# EAGLE design raspi-adapter (EAGLE 6.5.0)
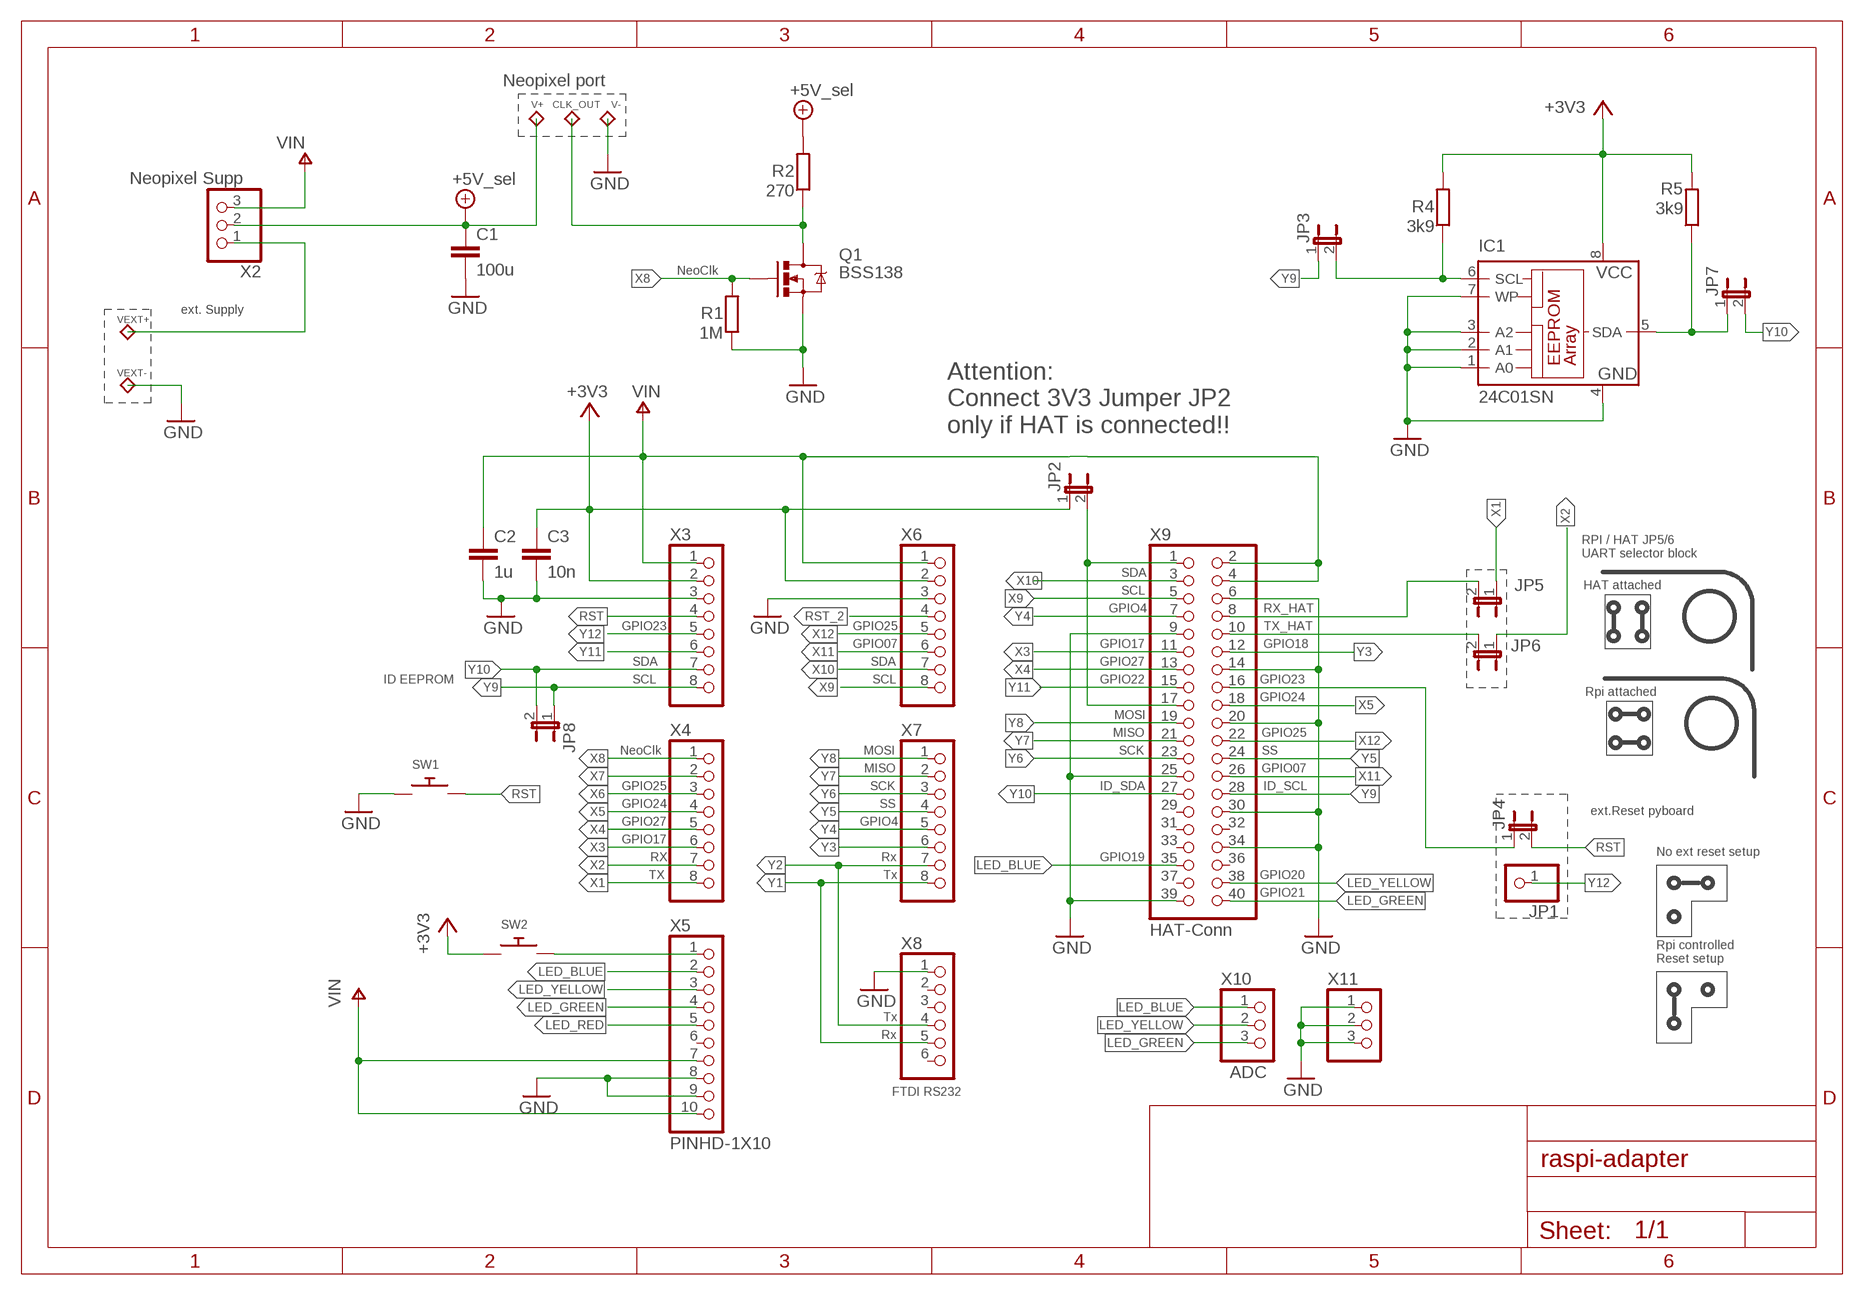
[diagram p0: schematic, sheet 1]

## Parts
C1  100u  C-EUC2220K  [C2220K]
C2  1u  C-EUC0603  [C0603]
C3  10n  C-EUC0603  [C0603]
CLK_OUT  TP_BATT  [TP_BATT_GROSS]
IC1  24C01SN  [SO-08]
JP1  PINHD-1X1  [1X01]
JP2  JUMPER-2PTH  [1X02]
JP3  JUMPER-2PTH  [1X02]
JP4  JUMPER-2PTH  [1X02]
JP5  JUMPER-2PTH  [1X02]
JP6  JUMPER-2PTH  [1X02]
JP7  JUMPER-2PTH  [1X02]
JP8  JUMPER-2PTH  [1X02]
Q1  BSS138  MOSFET-NCHANNELBSS123LT1G  [SOT23]
R1  1M  R-EU_R0603  [R0603]
R2  270  R-EU_R0603  [R0603]
R4  3k9  R-EU_R0603  [R0603]
R5  3k9  R-EU_R0603  [R0603]
SW1  SWITCH_PUSHBUTTONSOFTTOUCHSMD_SJ  [PUSHBUTTON_SMD_SJ]
SW2  SWITCH_PUSHBUTTONSOFTTOUCHSMD_SJ  [PUSHBUTTON_SMD_SJ]
V+  V+  TP_BATT  [TP_BATT_GROSS]
V-  TP_BATT  [TP_BATT_GROSS]
VEXT+  TP_BATT  [TP_BATT_GROSS]
VEXT-  TP_BATT  [TP_BATT_GROSS]
X2  PINHD-1X3  [1X03]
X3  PINHD-1X8CLEANBIG  [1X08-CLEANBIG]
X4  PINHD-1X8CLEANBIG  [1X08-CLEANBIG]
X5  PINHD-1X10  [1X10-BIG]
X6  PINHD-1X8CLEANBIG  [1X08-CLEANBIG]
X7  PINHD-1X8CLEANBIG  [1X08-CLEANBIG]
X8  PINHD-1X6B  [1X06-BIG]
X9  HAT-Conn  PINHD-2X20  [2X20]
X10  PINHD-1X3  [1X03]
X11  PINHD-1X3  [1X03]

## Nets
3V3_RPI: JP2.2 X9.1 X9.17
+3V3: C3.1 IC1.8(VCC) JP2.1 R4.2 R5.2 SW2.P$1 X3.2 X6.2
+5V: C1.1 R2.2 V+.1 X2.2 ; supply symbol labelled +5V_sel
GND: C1.2 C2.2 C3.2 IC1.1(A0) IC1.2(A1) IC1.3(A2) IC1.4(GND) IC1.7(WP) Q1.2(S) R1.1 SW1.P$1 V-.1 VEXT-.1 X3.3 X5.8 X5.9 X6.3 X8.1 X9.6 X9.9 X9.14 X9.20 X9.25 X9.30 X9.34 X9.39 X11.1 X11.2 X11.3
LED_BLUE: X5.2 X9.35 X10.1
LED_GREEN: X5.4 X9.40 X10.3
LED_RED: X5.5
LED_YELLOW: X5.3 X9.38 X10.2
N$2: VEXT+.1 X2.1
N$4: SW2.P$2 X5.1
N$6: CLK_OUT.1 Q1.3(D) R2.1
N$7: JP4.1 X9.16
RST: JP4.2 SW1.P$2 X3.4
RST_2: X6.4
SCL: IC1.6(SCL) JP3.2 R4.1
SDA: IC1.5(SDA) JP7.1 R5.1
V+: C2.1 X2.3 X3.1 X6.1 X9.2 X9.4 ; supply symbol labelled VIN
VIN: X5.7 X5.10
X1: JP5.1 X4.8
X1_: JP5.2 X9.8
X2: JP6.1 X4.7
X2_2: JP6.2 X9.10
X3: X4.6 X9.11
X4: X4.5 X9.13
X5: X4.4 X9.18
X6: X4.3
X7: X4.2
X8: Q1.1(G) R1.2 X4.1
X9: X6.8 X9.5
X10: X6.7 X9.3
X11: X6.6 X9.26
X12: X6.5 X9.22
Y1: X7.8 X8.5
Y2: X7.7 X8.4
Y3: X7.6 X9.12
Y4: X7.5 X9.7
Y5: X7.4 X9.24
Y6: X7.3 X9.23
Y7: X7.2 X9.21
Y8: X7.1 X9.19
Y9: JP3.1 JP8.1 X3.8 X9.28
Y10: JP7.2 JP8.2 X3.7 X9.27
Y11: X3.6 X9.15
Y12: JP1.1 X3.5
Unconnected: X5.6 X8.2 X8.3 X8.6 X9.29 X9.31 X9.32 X9.33 X9.36 X9.37

## Notes on the sheet
- Neopixel port
- Neopixel Supp
- NeoClk
- ext. Supply
- Attention:
  Connect 3V3 Jumper JP2
  only if HAT is connected!!
- RPI / HAT JP5/6
  UART selector block
- SDA
- HAT attached
- SCL
- GPIO4 | RX_HAT
- GPIO23 | GPIO25 | TX_HAT
- GPIO07 | GPIO17 | GPIO18
- SDA | SDA | GPIO27
- ID EEPROM | SCL | SCL | GPIO22 | GPIO23
- Rpi attached
- GPIO24
- MOSI
- MISO
- GPIO25
- SCK | SS
- NeoClk | MOSI
- MISO
- GPIO07
- SCK
- GPIO25 | ID_SDA | ID_SCL
- SS
- GPIO24
- ext.Reset pyboard
- GPIO27 | GPIO4
- GPIO17
- No ext reset setup
- RX | Rx | GPIO19
- TX | Tx | GPIO20
- GPIO21
- Rpi controlled 
  Reset setup
- Tx
- Rx
- ADC
- FTDI RS232

## Library data of the parts
C1-C3 = rcl:C-EU: CAPACITOR, European symbol
CLK_OUT V+ V- VEXT+ VEXT- = GasDemo:TP_BATT
IC1 = microchip:24C*: Serial EEPROM 1 K/2 K/4 K; MPN: CAT24C01WI-GT3; OC_FARNELL: 1718117; OC_NEWARK: 06R0487
JP1 = adafruit:PINHD-1X1: Pin header 1x1 for 0.1" spacing With round pins
JP2-JP8 = SparkFun-Passives:JUMPER-2: Jumper Basic 0.1" spaced jumper. Use with breakaway headers.
Q1 = SparkFun-DiscreteSemi:MOSFET-NCHANNEL: Common NMOSFET Parts MFG P/N Store ID Prod ID FDD8780 TRANS-09984 SI7820DN TRANS-11055 FDS6630A IC-08089 2N7002PW TRANS-11151 FQP30N06L COM-10213 TRANS-10060 BSS123LT1G TRANS-08345 BSS138 TRANS-00830 BS170 2N7000; PROD_ID: TRANS-08345
R1 R2 R4 R5 = resistor:R-EU_: RESISTOR, European symbol
SW1 SW2 = adafruit:SWITCH_PUSHBUTTON: Buttons SOFTTOUCHSMD_SJ - Soft touch temporary push button (Super Junk Akihabara) Compatible with SKPMANE010 [Mouser: 688-SKPMAN] C&K_KSS = Digikey: KSS221GLFS
X2 X10 X11 = adafruit:PINHD-1X3: PIN HEADER
X3 X4 X6 X7 = adafruit:PINHD-1X8: PIN HEADER
X5 = adafruit:PINHD-1X10: Pin header 1x10 0.1" spacing With round pins
X8 = adafruit:PINHD-1X6: PIN HEADER
X9 = adafruit:PINHD-2X20: PIN HEADER

## Board
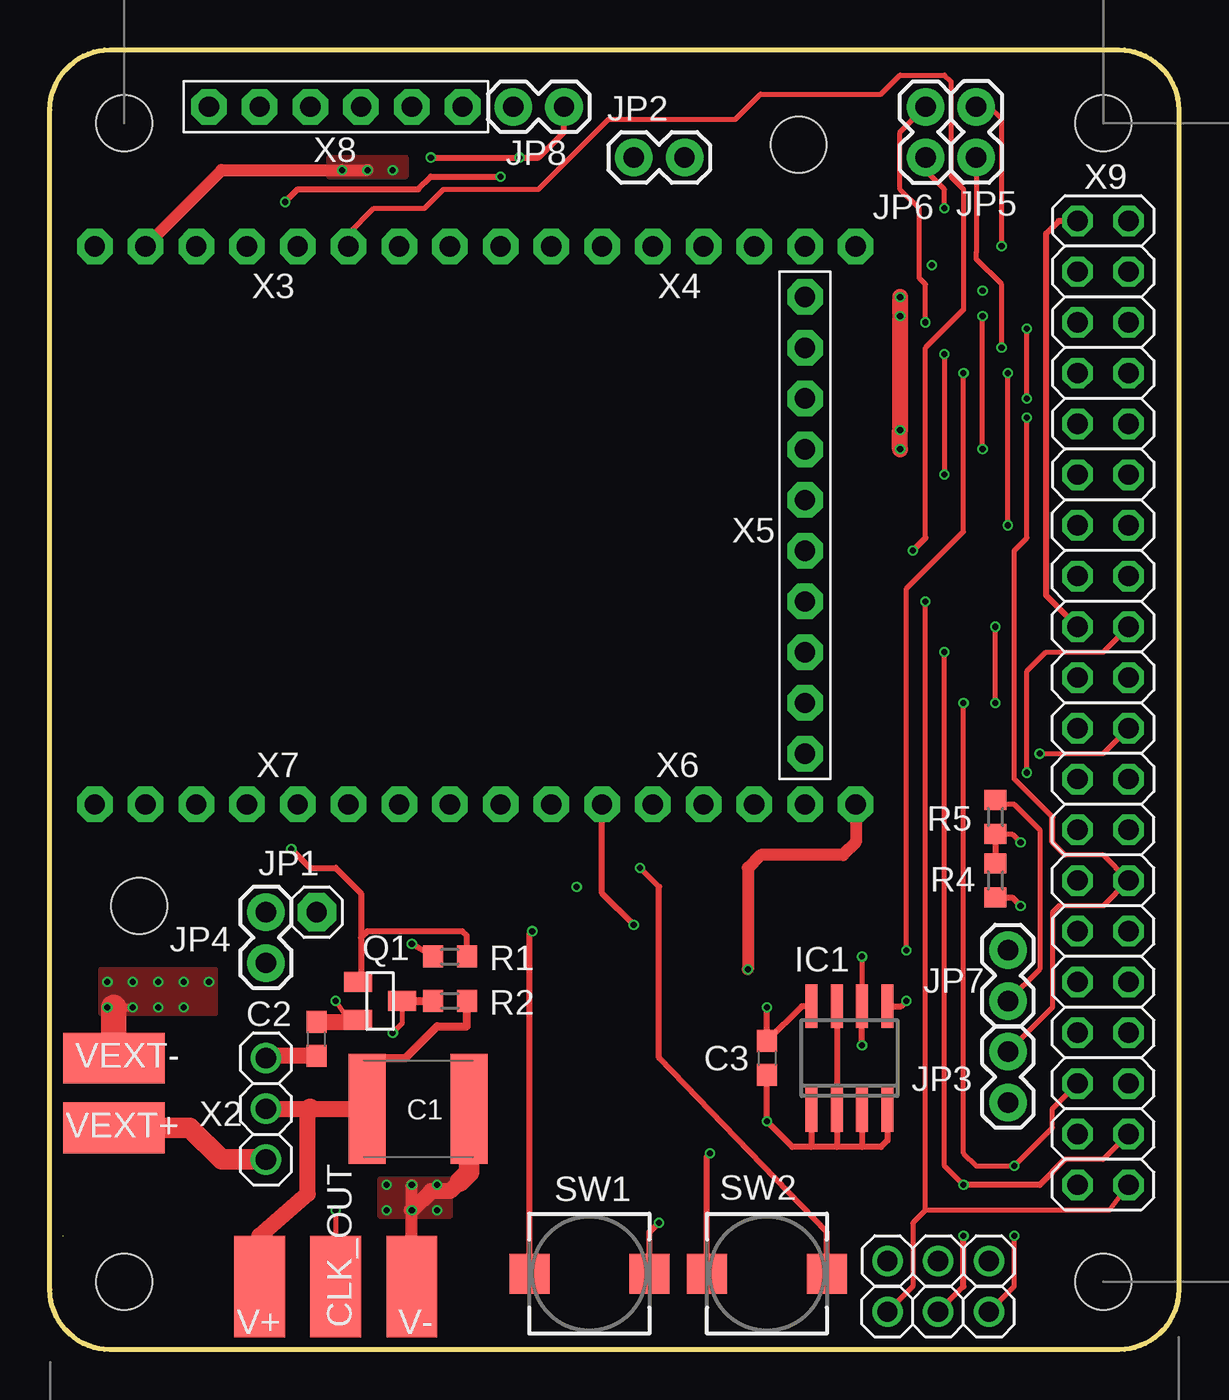
[diagram p1: board, top side]
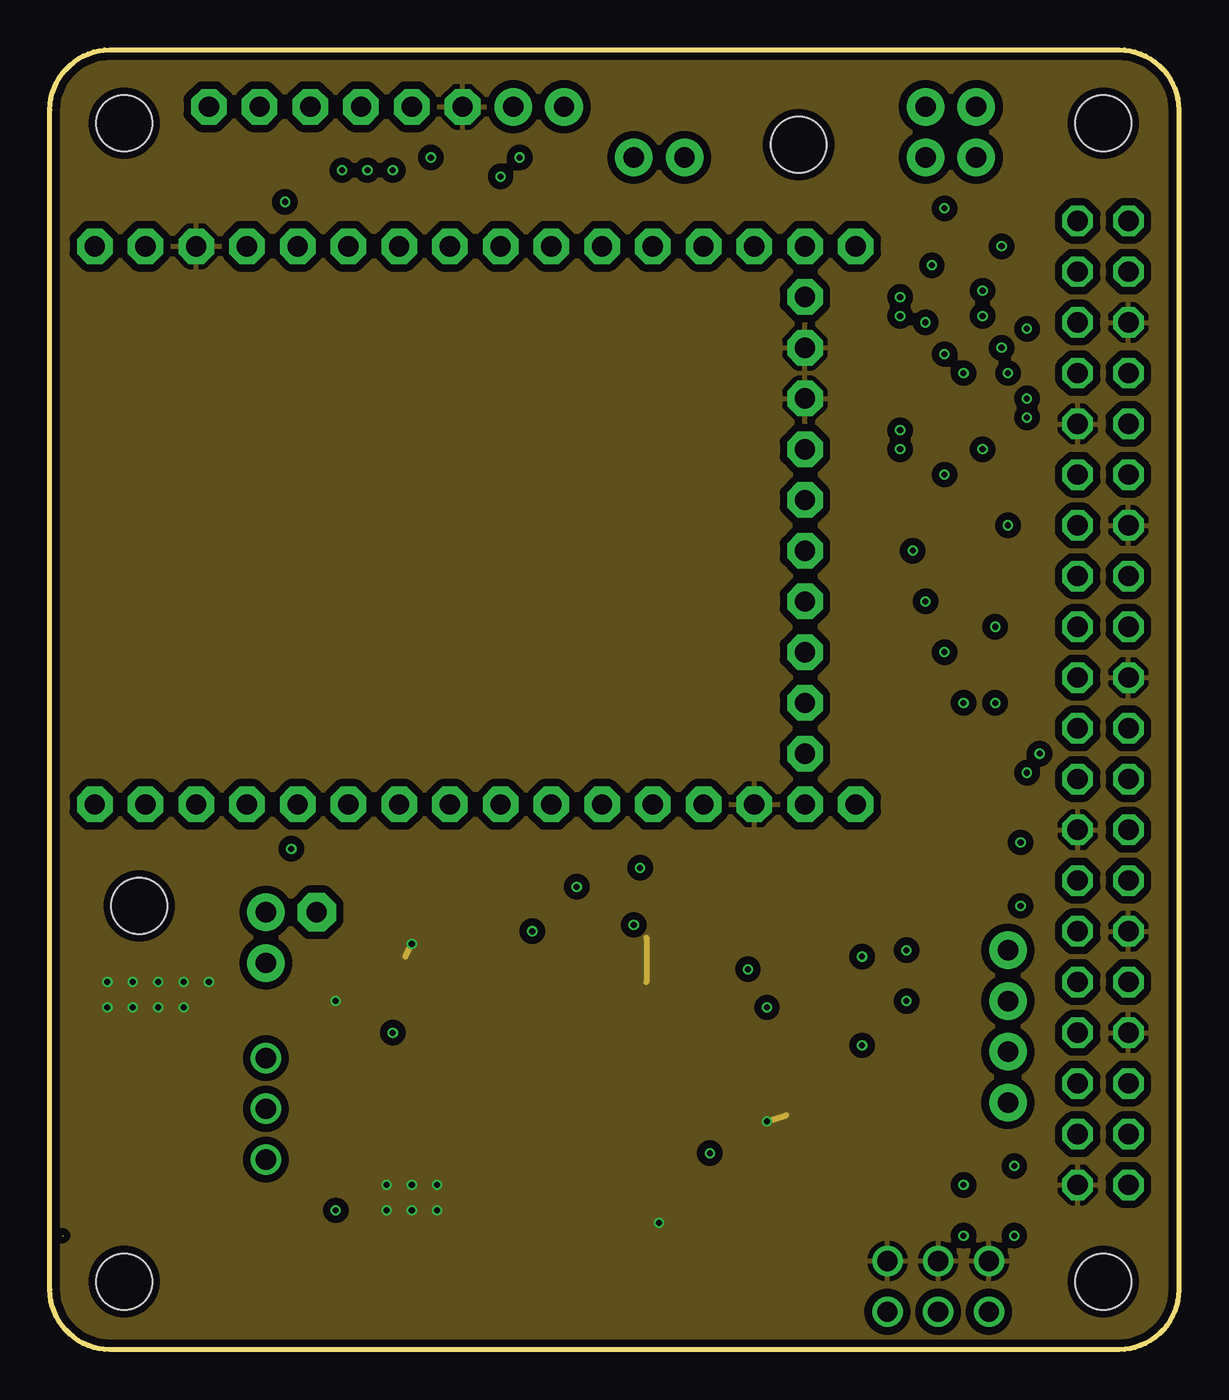
[diagram p2: board, inner layer Route2]
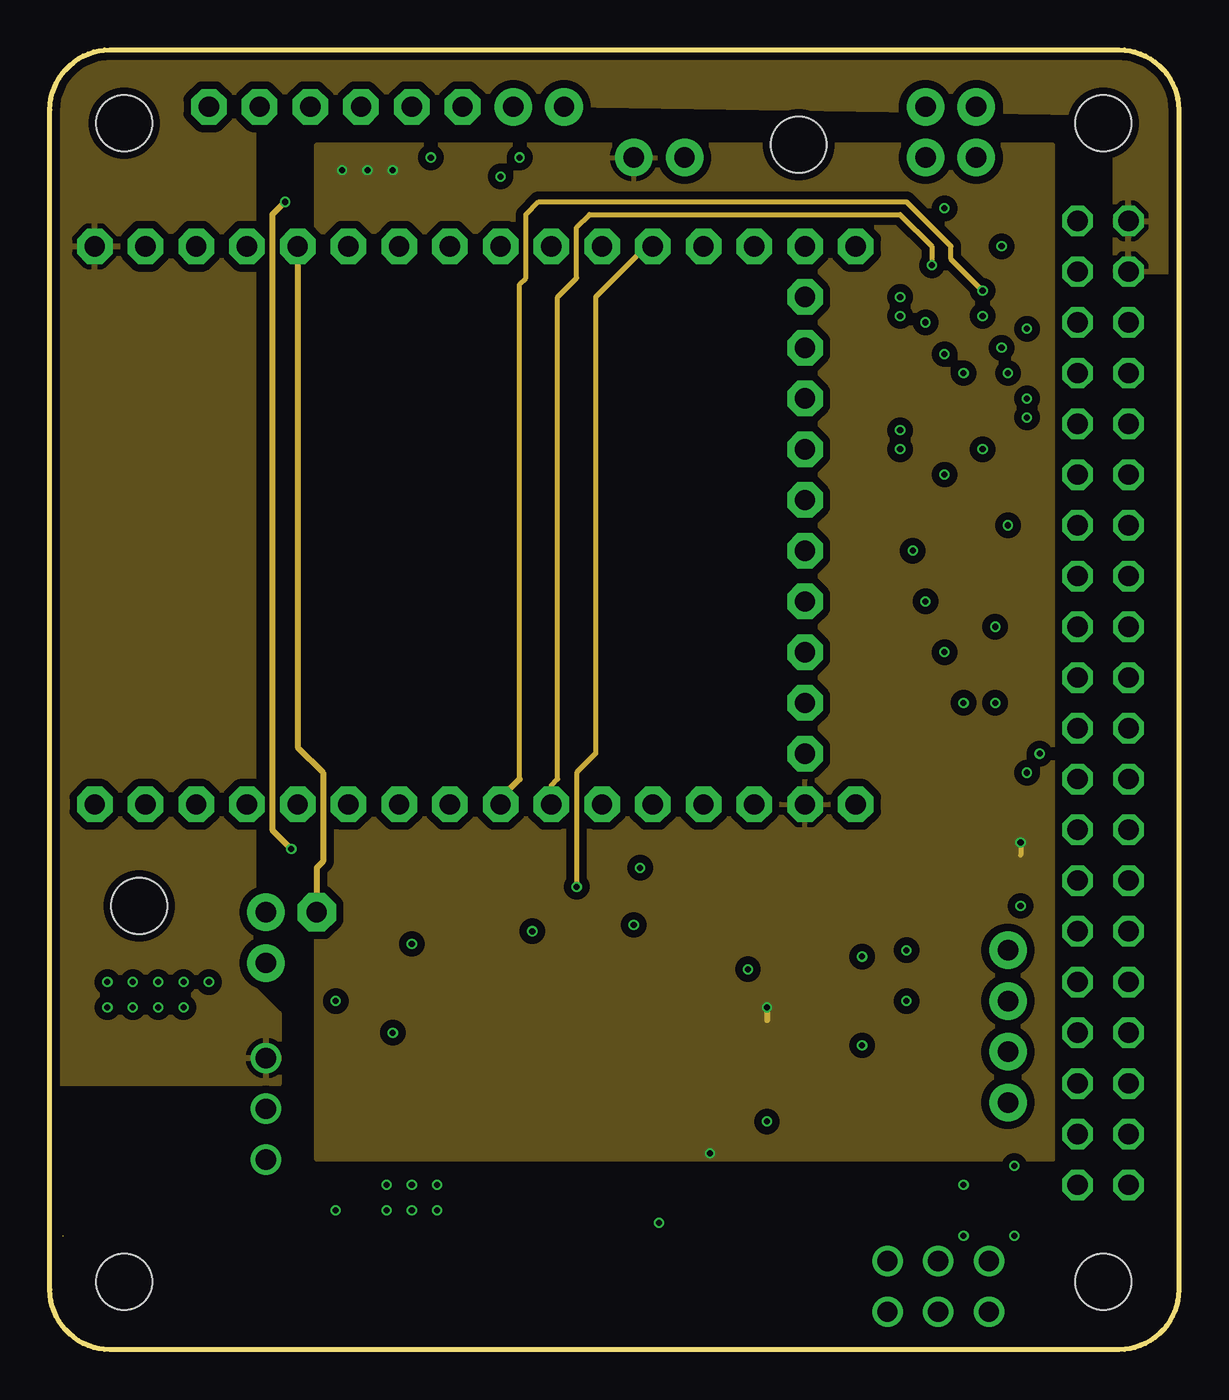
[diagram p3: board, inner layer Route15]
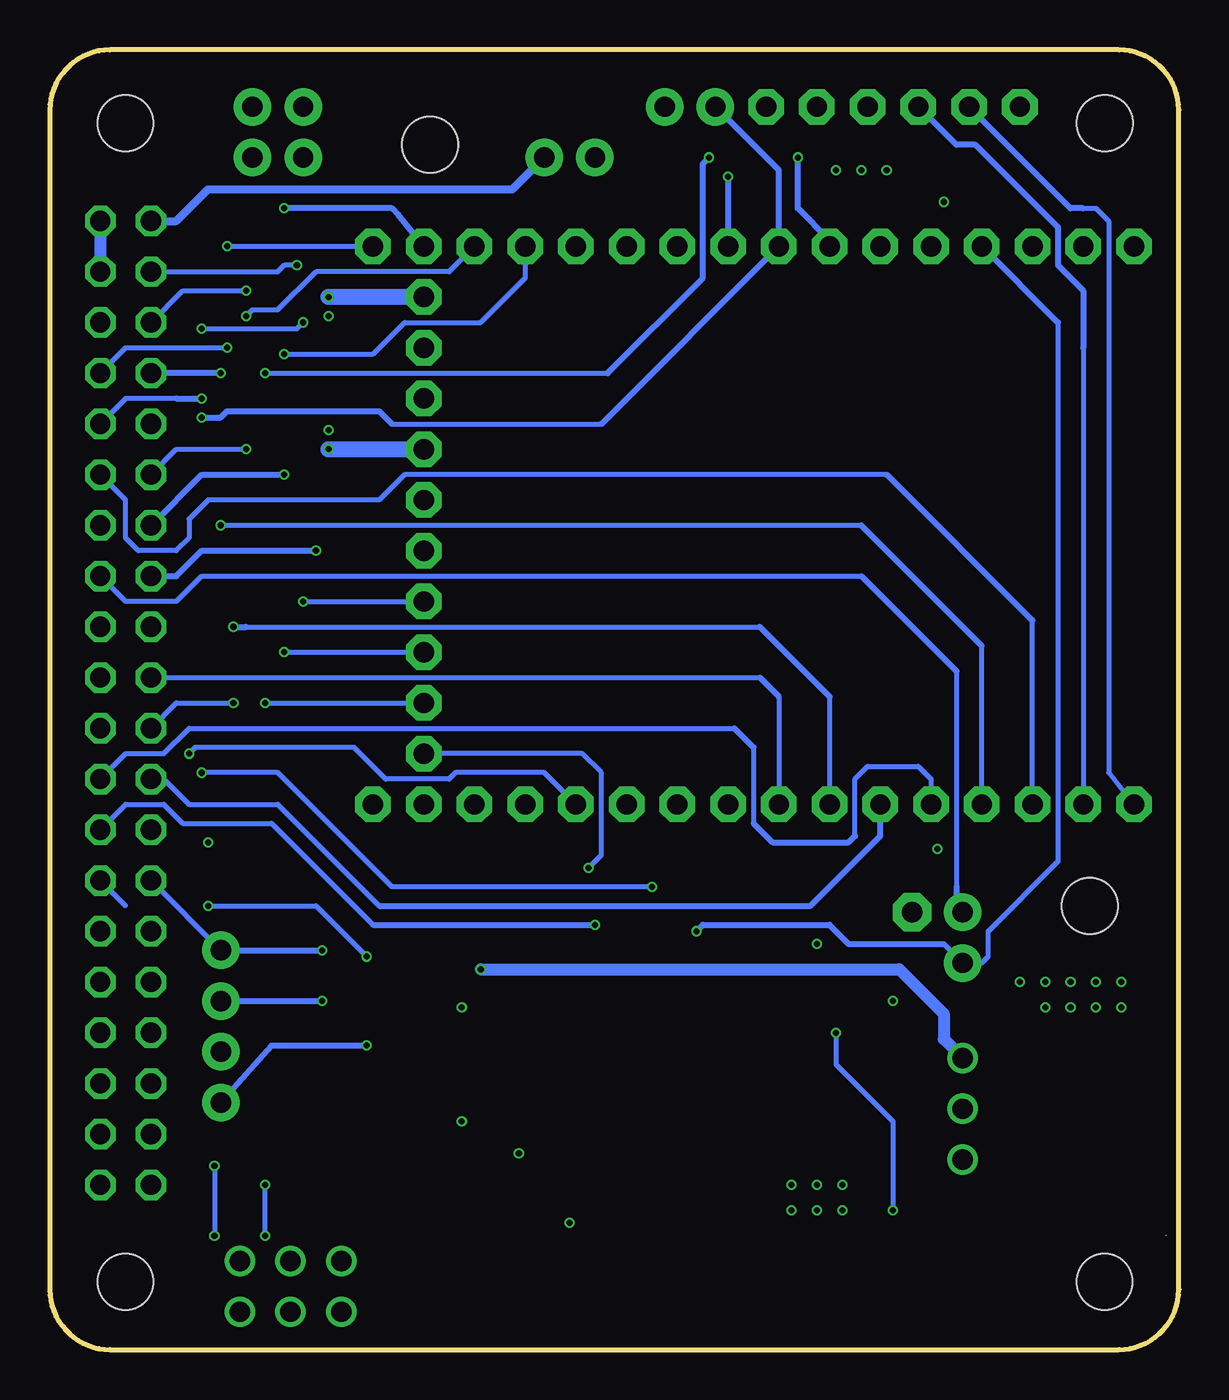
[diagram p4: board, bottom side, seen from below]

Size 56.52 x 65.06 mm. Coordinates in mm from the lower left corner, seen from the top.
Outline: 0.63,5.7 0.65,5.7
Outline: 56.52,62.06 56.52,3 arc-90 53.52,0 3,0 arc-90 0,3 0,62.06 arc-90 3,65.06 53.52,65.06 arc-90 56.52,62.06
Copper layers (1*2*15*16): Top 0.035559375mm / dielectric 0.17018125mm / Route2 0.01778125mm / dielectric 47mil / Route15 0.01778125mm / dielectric 0.17018125mm / Bottom 0.035559375mm
Design rules "OSHPark-4layer": minimum track width 5mil, minimum drill 10mil, track to track 5mil, track to pad 5mil, pad to pad 5mil, via to via 5mil, smd to smd 5mil, copper to edge 15mil, drill to drill 6mil, minimum pad ring 4mil, minimum via ring 4mil, stop-mask expansion 2.5mil, vias tented up to drill 0mil, thermal gap 10mil
Holes 2.8 mm at 4.46,22.21 37.48,60.31 52.73,3.4 52.73,61.4 3.71,61.4 3.72,3.4

### Footprints (pad centres in the part's own frame; a part is rotated, then mirrored left to right if it is on the bottom)
C2220K = smd 1.85 x 5.5: 1 -2.55,0; 2 2.55,0
C0603 = smd 1.1 x 1: 1 -0.85,0; 2 0.85,0
TP_BATT_GROSS = smd 5.08 x 2.54: 1 0,0
SO-08 = smd 0.6 x 2.2: 1 -1.905,-2.6; 2 -0.635,-2.6; 3 0.635,-2.6; 4 1.905,-2.6; 5 1.905,2.6; 6 0.635,2.6; 7 -0.635,2.6; 8 -1.905,2.6
1X01 = drill 1.016 pad 1.93 octagon: 1 0,0
1X02 = drill 1.016 pad 1.88: 1 0,0; 2 2.54,0
SOT23 = smd 1 x 1.4: 1 -0.95,-1.1; 2 0.95,-1.1; 3 0,1.1
R0603 = smd 1 x 1.1: 1 -0.85,0; 2 0.85,0
PUSHBUTTON_SMD_SJ = smd 2 x 2: P$1 3,0; P$2 -3,0
1X03 = drill 1.016: 1 -2.54,0; 2 0,0; 3 2.54,0
1X08-CLEANBIG = drill 1.016 pad 1.778 octagon: 1 -8.89,0; 2 -6.35,0; 3 -3.81,0; 4 -1.27,0; 5 1.27,0; 6 3.81,0; 7 6.35,0; 8 8.89,0
1X10-BIG = drill 1.016 pad 1.778 octagon: 1 -11.43,0; 2 -8.89,0; 3 -6.35,0; 4 -3.81,0; 5 -1.27,0; 6 1.27,0; 7 3.81,0; 8 6.35,0; 9 8.89,0; 10 11.43,0
1X06-BIG = drill 1.016 pad 1.778 octagon: 1 -6.35,0; 2 -3.81,0; 3 -1.27,0; 4 1.27,0; 5 3.81,0; 6 6.35,0
2X20 = drill 1.016 octagon: 1 -24.13,-1.27; 2 -24.13,1.27; 3 -21.59,-1.27; 4 -21.59,1.27; 5 -19.05,-1.27; 6 -19.05,1.27; 7 -16.51,-1.27; 8 -16.51,1.27; 9 -13.97,-1.27; 10 -13.97,1.27; 11 -11.43,-1.27; 12 -11.43,1.27; 13 -8.89,-1.27; 14 -8.89,1.27; 15 -6.35,-1.27; 16 -6.35,1.27; 17 -3.81,-1.27; 18 -3.81,1.27; 19 -1.27,-1.27; 20 -1.27,1.27; 21 1.27,-1.27; 22 1.27,1.27; 23 3.81,-1.27; 24 3.81,1.27; 25 6.35,-1.27; 26 6.35,1.27; 27 8.89,-1.27; 28 8.89,1.27; 29 11.43,-1.27; 30 11.43,1.27; 31 13.97,-1.27; 32 13.97,1.27; 33 16.51,-1.27; 34 16.51,1.27; 35 19.05,-1.27; 36 19.05,1.27; 37 21.59,-1.27; 38 21.59,1.27; 39 24.13,-1.27; 40 24.13,1.27

### Placement (x,y rotation side)
C1  18.43,12.05 0 top
C2  13.36,15.54 90 top
C3  35.9,14.59 270 top
CLK_OUT  14.31,3.16 90 top
IC1  40.02,14.59 0 top
JP1  13.36,21.89 0 top
JP2  29.23,59.68 0 top
JP3  47.96,14.91 270 top
JP4  10.82,21.89 270 top
JP5  46.38,62.22 270 top
JP6  43.84,59.68 90 top
JP7  47.96,17.45 90 top
JP8  23.2,62.22 0 top
Q1  16.53,17.45 270 top
R1  20.02,19.67 0 top
R2  20.02,17.45 0 top
R4  47.33,23.48 90 top
R5  47.33,26.66 270 top
SW1  27.01,3.8 0 top
SW2  35.9,3.8 180 top
V+  10.5,3.16 90 top
V-  18.12,3.16 90 top
VEXT+  3.2,11.1 180 top
VEXT-  3.2,14.59 180 top
X2  10.82,12.05 90 top
X3  11.13,55.23 0 top
X4  31.45,55.23 0 top
X5  37.8,41.26 90 top
X6  31.45,27.29 180 top
X7  11.13,27.29 180 top
X8  14.31,62.22 180 top
X9  52.73,32.37 270 top
X10  44.47,1.89 180 top
X11  44.47,4.43 0 top

### Tracks (layer width: path | path; a pad name or v marks a point on that pad's centre or on a via)
3V3_RPI
  Top 0.305: X9.1 50.5,56.5 49.87,55.87 49.87,37.77 X9.17
  Bottom 0.406: X9.1 50.19,56.5 48.6,58.09 33.36,58.09 JP2.2
+3V3  (via drill 0.3)
  Top 0.254: R5.2 48.18,25.81 v48.6,25.39
  Top 0.305: IC1.8 37.65,17.19 C3.1 v35.9,17.13 | R5.2 R4.2 | SW2.P$1 32.9,9.69 v33.04,9.83
  Top 0.61: X3.2 8.59,59.04 v14.62,59.04 v15.89,59.04
  Route15 0.254: v48.6,25.39 48.6,24.75
  Route15 0.305: v35.9,17.13 35.9,16.5
  other vias: 17.16,59.04
  pour Route15 (isolate 0.381): 13.36,60.31 50.19,60.31 50.19,9.51 13.36,9.51
  pour Top: 17.8,59.68 17.8,58.72 13.99,58.72 13.99,59.68
+5V
  Top 0.406: C1.1 15.13,13.83 15.89,14.59 17.8,14.59 19.39,16.18 20.87,16.18 R2.2
  Top 0.813: V+.1 10.5,5.7 12.91,7.8 12.91,11.92 | X2.2 13.04,12.05 C1.1
  Top 1.016: 12.91,11.92 13.04,12.05
GND  (via drill 0.3)
  Top 0.254: Q1.2 14.95,16.5 v14.31,17.45
  Top 0.305: IC1.4 41.93,10.46 41.61,10.15 40.66,10.15 | 40.66,10.15 39.39,10.15 | 39.39,10.15 38.12,10.15 | 38.12,10.15 37.17,10.15 v35.9,11.42 C3.2 | IC1.1 38.12,10.15 | 39.39,10.15 IC1.2 IC1.7 | IC1.3 40.66,10.15 | SW1.P$1 30.01,5.88 v30.5,6.34 | R1.1 v18.12,20.31
  Top 0.406: 3.2,17.13 v4.15,17.13
  Top 0.61: V-.1 v18.12,6.97 v18.12,8.24
  Top 0.813: C2.2 15.32,16.4 Q1.2 | 20.53,8.43 20.02,7.93 19.07,7.93 v18.12,6.97
  Top 1.016: C1.2 20.98,8.88 20.53,8.43
  Top 1.27: VEXT-.1 3.2,17.13
  Route2 0.305: 29.87,20.63 29.87,18.4 | v35.9,11.42 36.85,11.74 | v18.12,20.31 17.8,19.67
  other vias: 2.88,17.13 5.42,17.13 5.42,18.4 4.15,18.4 2.88,18.4 6.69,17.13 7.96,18.4 6.69,18.4 16.85,6.97 19.39,6.97 19.39,8.24 16.85,8.24
  pour Route2 (isolate 0.381): -3.16,66.66 59.07,66.66 59.07,-0.65 -3.16,-0.65
  pour Top: 2.56,19.04 8.28,19.04 8.28,16.81 2.56,16.81
  pour Top: 16.53,8.56 20.02,8.56 20.02,6.65 16.53,6.65
LED_BLUE  (via drill 0.3)
  Top 0.254: v45.74,32.37 45.74,9.83 46.38,9.19 v48.28,9.19 50.19,11.1 50.19,12.05 X9.35 | 47.33,2.21 48.28,3.16 v48.28,5.7
  Top 0.305: X10.1 47.33,2.21
  Bottom 0.254: v45.74,32.37 X5.2 | v48.28,9.19 v48.28,5.7
LED_GREEN  (via drill 0.3)
  Top 0.254: X9.40 53.04,6.97 43.84,6.97 | 43.84,6.97 v43.84,37.45 | 43.84,6.97 43.2,6.34 43.2,3.16 X10.3
  Bottom 0.254: v43.84,37.45 X5.4
LED_YELLOW  (via drill 0.3)
  Top 0.254: X9.38 52.73,9.51 50.82,9.51 | v45.74,8.24 44.79,9.19 v44.79,34.91 | 44.79,2.21 45.74,3.16
  Top 0.305: 50.82,9.51 49.55,8.24 v45.74,8.24 | X10.2 44.79,2.21 | 45.74,3.16 v45.74,5.7
  Bottom 0.254: v44.79,34.91 X5.3 | v45.74,5.7 v45.74,8.24
N$2
  Top 1.016: X2.1 8.59,9.51 7,11.1 VEXT+.1
N$4  (via drill 0.3)
  Top 0.254: 30.5,23.17 v29.55,24.12
  Top 0.305: SW2.P$2 38.9,5.88 30.5,14.59 30.5,23.17
  Bottom 0.254: v29.55,24.12 28.91,24.75 28.91,28.88 29.87,29.83 X5.1
N$6  (via drill 0.3)
  Top 0.254: v14.31,6.97 CLK_OUT.1 | Q1.3 17.63,16.33 v17.16,15.86
  Top 0.305: 14.94,1.89 CLK_OUT.1
  Top 0.406: Q1.3 18.65,17.45 R2.1
  Bottom 0.254: v14.31,6.97 14.31,11.42 17.16,14.27 v17.16,15.86
N$7
  Bottom 0.254: 15.89,38.72 48.91,38.72 50.19,37.45 52.73,37.45 X9.16 | 11.13,33.96 11.13,23.17
  Bottom 0.305: 15.89,38.72 11.13,33.96 | 11.13,23.17 11.13,22.53 10.82,22.21 JP4.1
RST  (via drill 0.3)
  Top 0.305: SW1.P$2 24.01,20.8 v24.15,20.94
  Bottom 0.254: 6.05,51.42 6.05,24.43 9.54,20.94 9.54,19.67 9.86,19.36 JP4.2 11.77,20.31
  Bottom 0.305: X3.4 6.05,51.42 | v24.15,20.94 23.83,21.26 17.48,21.26 16.53,20.31 11.77,20.31
SCL  (via drill 0.3)
  Top 0.254: v40.66,19.67 IC1.6
  Top 0.305: v40.66,15.23 IC1.6 | R4.1 48.18,22.63 v48.6,22.21
  Bottom 0.254: v48.6,22.21 43.2,22.21 v40.66,19.67
  Bottom 0.305: JP3.2 45.42,15.23 v40.66,15.23
SDA  (via drill 0.3)
  Top 0.254: JP7.1 49.55,19.04 49.55,26.02 48.28,27.29 47.54,27.29
  Top 0.305: IC1.5 42.62,17.19 v42.88,17.45 | 47.54,27.29 R5.1
  Bottom 0.305: JP7.1 v42.88,17.45
V+  (via drill 0.3)
  Top 0.61: X6.1 40.34,25.39 39.71,24.75 35.58,24.75 34.95,24.12 v34.95,19.04
  Top 0.813: C2.1 10.92,14.69 X2.3
  Bottom 0.61: v34.95,19.04 13.99,19.04 11.77,16.81 11.77,15.54 X2.3 | X9.2 X9.4
  pour Route15 (isolate 0.381): 0.02,65.07 57.8,65.07 57.8,53.96 53.36,53.96 53.36,61.9 11.13,62.53 10.18,61.58 10.18,18.08 11.45,16.81 11.45,13.32 0.02,13.32
VIN  (via drill 0.3)
  Top 0.813: v42.56,51.74 v42.56,52.69 v42.56,46.03 v42.56,45.07
  Bottom 0.813: X5.10 v42.56,52.69 | v42.56,45.07 X5.7
X1  (via drill 0.3)
  Top 0.254: v47.65,55.23 47.65,61.58 47.01,62.22 JP5.1
  Bottom 0.254: v47.65,55.23 X4.8
X1_  (via drill 0.3)
  Top 0.254: JP5.2 46.38,54.91 46.38,54.6 47.65,53.33 v47.65,50.15
  Bottom 0.254: X9.8 52.73,50.15 v47.65,50.15
X2  (via drill 0.3)
  Top 0.254: v44.79,57.14 44.79,58.09 44.15,58.72 43.84,59.04 JP6.1
  Bottom 0.305: X4.7 39.07,56.82 39.39,57.14 v44.79,57.14
X2_2  (via drill 0.3)
  Top 0.254: JP6.2 42.56,60.95 42.56,58.09 43.52,57.14 43.52,53.65 43.84,53.33 v43.84,51.42 | v48.91,47.61 v48.91,51.11
  Bottom 0.254: 50.19,47.61 52.73,47.61 X9.10 | v48.91,51.11 44.15,51.11 v43.84,51.42
  Bottom 0.305: 50.19,47.61 v48.91,47.61
X3  (via drill 0.3)
  Top 0.254: v46.69,45.07 v46.69,51.74
  Bottom 0.254: X4.6 36.53,53.96 43.2,53.96 45.1,52.06 46.38,52.06 v46.69,51.74 | X9.11 50.19,45.07 v46.69,45.07
X4  (via drill 0.3)
  Top 0.254: v44.79,49.83 v44.79,43.8
  Bottom 0.254: X4.5 32.72,53.65 34.95,51.42 38.76,51.42 40.34,49.83 v44.79,49.83
  Bottom 0.305: X9.13 48.91,43.8 v44.79,43.8
X5  (via drill 0.3)
  Top 0.254: v48.91,28.88 48.91,33.96 49.87,34.91 52.73,34.91 X9.18
  Route15 0.254: X4.4 29.87,55.23 27.33,52.69 27.33,29.83 26.37,28.88 v26.37,23.17
  Bottom 0.254: v26.37,23.17 39.39,23.17 45.1,28.88 v48.91,28.88
X8  (via drill 0.3)
  Top 0.305: v12.09,25.07 13.04,24.12 14.31,24.12 15.58,22.85 15.58,20.63 | 15.58,20.63 15.58,18.55 Q1.1 | R1.2 20.87,20.73 20.66,20.94 15.89,20.94 15.58,20.63 | v11.77,57.46 12.4,58.09 18.43,58.09 19.07,58.72 v22.56,58.72
  Route15 0.305: v12.09,25.07 11.13,26.02 11.13,56.82 v11.77,57.46
  Bottom 0.305: v22.56,58.72 X4.1
X9  (via drill 0.3)
  Route15 0.254: 23.52,28.56 23.52,53.33 23.83,53.65 23.83,56.82 24.47,57.46 42.88,57.46 45.1,55.23 45.1,54.6 v46.69,53.01
  Route15 0.305: X6.8 22.56,27.61 23.52,28.56
  Bottom 0.254: X9.5 49.87,53.01 v46.69,53.01
X10  (via drill 0.3)
  Route15 0.254: X6.7 25.1,28.24 25.42,28.56 25.42,52.69 26.37,53.65 26.37,56.18 27.01,56.82 42.56,56.82 44.15,55.23 v44.15,54.28
  Bottom 0.254: X9.3 45.1,53.96 44.79,54.28 v44.15,54.28
X11  (via drill 0.3)
  Top 0.305: v29.23,21.26 27.64,22.85 X6.6
  Bottom 0.254: X9.26 52.73,27.29 50.82,27.29 49.87,26.34 45.42,26.34 40.34,21.26
  Bottom 0.305: 40.34,21.26 v29.23,21.26
X12  (via drill 0.3)
  Top 0.254: v49.55,29.83 52.73,29.83 X9.22
  Bottom 0.254: X6.5 31.77,28.88 36.21,28.88 36.53,28.56 39.71,28.56 41.3,30.15 49.23,30.15 v49.55,29.83
Y1
  Bottom 0.254: 4.78,57.14 4.15,57.14 3.51,56.5 3.51,28.88 X7.8
  Bottom 0.305: 4.78,57.14 5.42,57.14 X8.5
Y2
  Bottom 0.254: 4.78,50.15 X7.7
  Bottom 0.305: 4.78,50.15 4.78,53.01 6.05,54.28 6.05,56.18 10.18,60.31 11.13,60.31 X8.4 13.04,61.9
Y3
  Bottom 0.254: X7.6 7.32,36.5 | 14.62,43.8 38.76,43.8 40.02,42.53 48.6,42.53 49.55,41.58 49.55,40.63 50.19,39.99 52.09,39.99 52.73,40.63 52.73,42.53 X9.12
  Bottom 0.305: 7.32,36.5 14.62,43.8
Y4  (via drill 0.3)
  Top 0.254: v47.96,41.26 v47.96,48.88
  Bottom 0.254: X7.5 9.86,35.23 | 15.89,41.26 v47.96,41.26
  Bottom 0.305: 9.86,35.23 15.89,41.26 | v47.96,48.88 X9.7
Y5
  Bottom 0.254: X9.24 52.73,29.83 50.82,29.83 49.55,31.1 22.25,31.1 | 21.29,30.15 21.29,26.34 | 16.21,25.7 16.21,28.56 15.58,29.2 13.04,29.2 12.4,28.56 X7.4
  Bottom 0.305: 22.25,31.1 21.29,30.15 | 21.29,26.34 20.34,25.39 16.53,25.39 16.21,25.7
Y6
  Bottom 0.254: X9.23 50.82,28.56 49.55,27.29 45.1,27.29 40.02,22.21
  Bottom 0.305: 40.02,22.21 18.43,22.21 14.94,25.7 X7.3
Y7  (via drill 0.3)
  Top 0.254: v47.33,32.37 v47.33,36.18
  Bottom 0.254: 46.69,36.18 20.98,36.18 | 17.48,32.69 X7.2 | X9.21 50.19,32.37 v47.33,32.37
  Bottom 0.305: 20.98,36.18 17.48,32.69 | v47.33,36.18 46.69,36.18
Y8
  Bottom 0.254: X9.19 20.98,33.64 | 20.02,32.69 X7.1
  Bottom 0.305: 20.98,33.64 20.02,32.69
Y9  (via drill 0.3)
  Top 0.254: 50.19,25.39 50.82,24.75 52.73,24.75 X9.28 52.73,22.21 50.5,22.21 50.19,21.9 50.19,17.13 JP3.1 | 50.19,26.66 48.28,28.56 48.28,39.99 48.91,40.63 v48.91,46.66
  Top 0.305: 50.19,25.39 50.19,26.66
  Bottom 0.254: X9.28 52.73,22.21 | 39.39,46.34 28.91,46.34
  Bottom 0.305: v48.91,46.66 47.96,46.66 47.65,46.98 40.02,46.98 39.39,46.34 | 28.91,46.34 X3.8 20.02,59.04 JP8.1
Y10  (via drill 0.3)
  Top 0.254: v42.88,19.99 42.88,38.09 45.74,40.94 v45.74,48.88
  Top 0.305: v19.07,59.68 v23.52,59.68 24.47,59.68 25.74,60.95 JP8.2
  Bottom 0.254: v45.74,48.88 28.59,48.88 | X9.27 JP7.2
  Bottom 0.305: 28.59,48.88 23.83,53.65 23.83,59.36 v23.52,59.68 | JP7.2 v42.88,19.99 | X3.7 17.48,55.55 19.07,57.14 v19.07,59.68
Y11  (via drill 0.3)
  Top 0.254: 43.84,40.63 43.84,50.15 45.74,52.06 45.74,58.09 45.1,58.72 45.1,63.49 44.79,63.8 42.56,63.8 41.61,62.85 35.58,62.85 34.31,61.58 27.96,61.58 24.47,58.09 19.7,58.09 18.75,57.14 16.21,57.14 14.94,55.87
  Top 0.305: v43.2,39.99 43.84,40.63 | X3.6 14.94,55.87
  Bottom 0.305: X9.15 50.19,38.72 48.91,39.99 v43.2,39.99
Y12
  Route15 0.305: X3.5 12.4,30.15 13.67,28.88 13.67,24.43 13.36,24.12 JP1.1

### Text on the board
TopWriting: 3V3 | I2C | UART6 | - | HAT | RP | 1 | <USB | Raspi/HAT | 11 | Pyboard | 21 | GP | RE | - | V0.1 | HAT-EE | Int | Neo | RST | DFU | +5V | A14 | A15 | B4 | - | + | -